# Altium schematic sheet uMultimeter_Exp_Sch.SchDoc: MicroMultimeter - EXP
size 127 x 101 mm; Author: Hom; CompanyName: KitSprout; DrawnBy: Hom; Engineer: Hom; Organization: KitSprout; Revision: A; SheetNumber: 1; SheetTotal: 1; License: CC BY-SA 4.0; Version: 2.0; LibVersion: 2.0; PageSetup: Record=PageOptions|CenterHorizontal=True|CenterVertical=True|PrintScale=1.00|XCorrection=1.00|YCorrection=1.00|PrintKind=0|BorderSize=5000000|LeftOffset=0|BottomOffset=0|Orientation=2|PaperLength=1000|PaperWidth=1000|Scale=100|PaperSource=7|PrintQuality=-3|MediaType=1|DitherType=10|PrintScaleMode=0|PaperKind=A4|PaperIndex=9
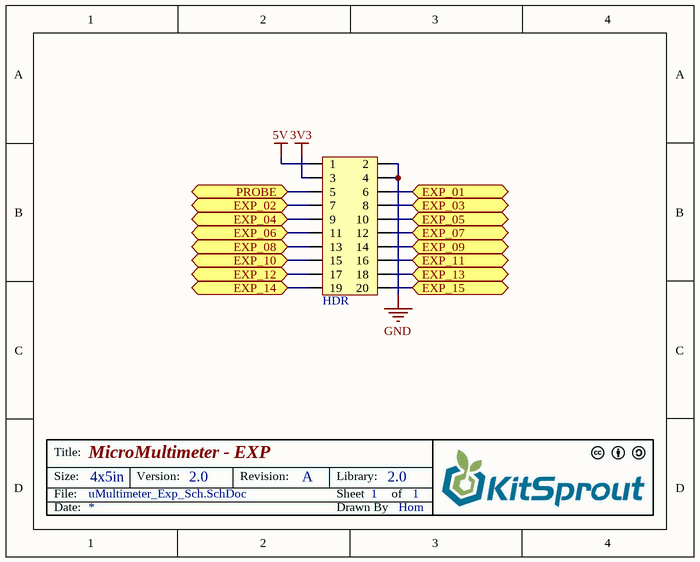
[diagram p0: uMultimeter_Exp_Sch.SchDoc]

## Parts
HDR  HDR2x10_2.54  [HDR2X10_2.54_180H]  (value not drawn)

## Ports
EXP_01, EXP_02, EXP_03, EXP_04, EXP_05, EXP_06, EXP_07, EXP_08, EXP_09, EXP_10, EXP_11, EXP_12, EXP_13, EXP_14, EXP_15, PROBE

## Nets
3V3: HDR.3
5V: HDR.1
GND: HDR.2 HDR.4
EXP_01: HDR.6 ; port EXP_01
EXP_02: HDR.7 ; port EXP_02
EXP_03: HDR.8 ; port EXP_03
EXP_04: HDR.9 ; port EXP_04
EXP_05: HDR.10 ; port EXP_05
EXP_06: HDR.11 ; port EXP_06
EXP_07: HDR.12 ; port EXP_07
EXP_08: HDR.13 ; port EXP_08
EXP_09: HDR.14 ; port EXP_09
EXP_10: HDR.15 ; port EXP_10
EXP_11: HDR.16 ; port EXP_11
EXP_12: HDR.17 ; port EXP_12
EXP_13: HDR.18 ; port EXP_13
EXP_14: HDR.19 ; port EXP_14
EXP_15: HDR.20 ; port EXP_15
PROBE: HDR.5 ; port PROBE

## Notes on the sheet
- Title:
- Size:
- Date:
- File:
- 4x5in
- Version:
- Revision:
- Sheet
- Drawn By
- Library:
- of

## Library data of the parts
HDR = HDR2x10_2.54: Header